# Altium schematic sheet Page-7.schdoc: I/O Addon
size 207 x 119 mm; CompanyName: InSYS; DrawnBy: NaveenKumar; Revision: 2.0; SheetNumber: 7; SheetTotal: 10; Title2: Gateway
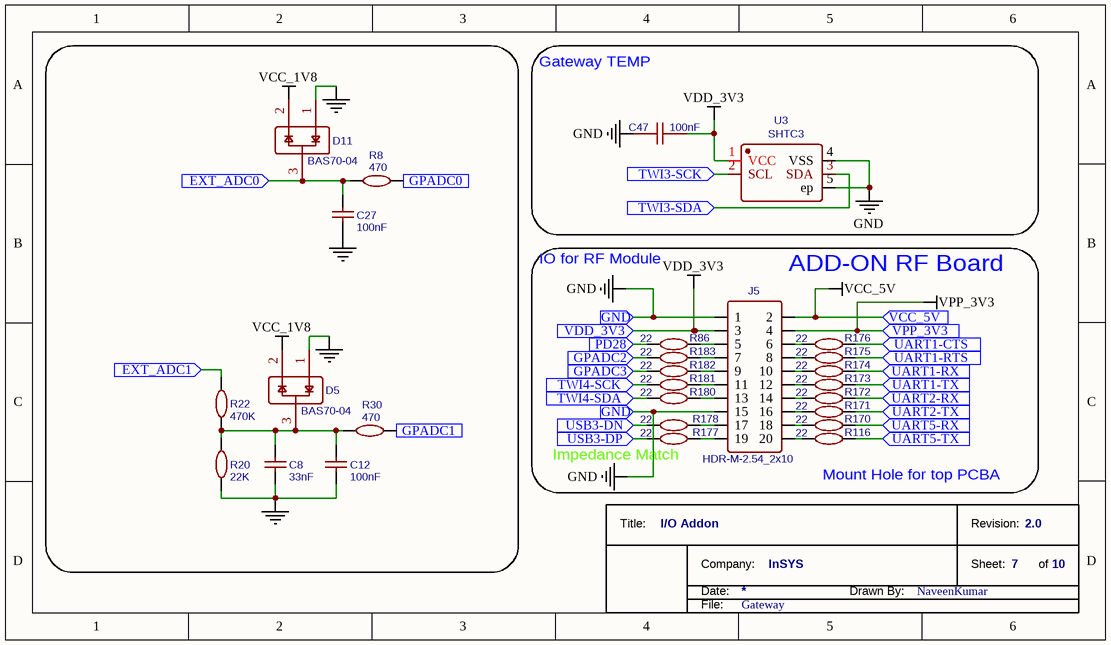
[diagram p0: Page-7.schdoc]

## Parts
*  TitleBlock_1  (value not drawn)  (graphical)
C8  33nF  [GWAY_Capacitor_0603]
C12  100nF  [GWAY_Capacitor_0603]
C27  100nF  [GWAY_Capacitor_0603]
C47  100nF  [GWAY_Capacitor_0603]
D5  BAS70-04  [GWAY_SOT23-3PIN]
D11  BAS70-04  [GWAY_SOT23-3PIN]
J5  HDR-M-2.54_2x10  [GWAY_2x10way_HEADER_CONN]
R8  470  [GWAY_Resistor_0603]
R20  22K  [GWAY_Resistor_0805]
R22  470K  [GWAY_Resistor_0603]
R30  470  [GWAY_Resistor_0603]
R86  22  [GWAY_Resistor_0603]
R116  22  [GWAY_Resistor_0603]
R170  22  [GWAY_Resistor_0603]
R171  22  [GWAY_Resistor_0603]
R172  22  [GWAY_Resistor_0603]
R173  22  [GWAY_Resistor_0603]
R174  22  [GWAY_Resistor_0603]
R175  22  [GWAY_Resistor_0603]
R176  22  [GWAY_Resistor_0603]
R177  22  [GWAY_Resistor_0603]
R178  22  [GWAY_Resistor_0603]
R180  22  [GWAY_Resistor_0603]
R181  22  [GWAY_Resistor_0603]
R182  22  [GWAY_Resistor_0603]
R183  22  [GWAY_Resistor_0603]
U3  SHTC3  [GWAY_DFN4_SHTC3]

## Blocks framed on the sheet
Gateway TEMP: C47 U3
ADD-ON RF Board: J5 R86 R116 R170-R178 R180-R183

## Ports
EXT_ADC0 (in), EXT_ADC1 (in), GND (in), GPADC0 (in), GPADC1 (in), GPADC2 (in), GPADC3 (in), PD28 (in), TWI3-SCK (in), TWI3-SDA (in), TWI4-SCK (in), TWI4-SDA (in), UART1-CTS (in), UART1-RTS (in), UART1-RX (in), UART1-TX (in), UART2-RX (in), UART2-TX (in), UART5-RX (in), UART5-TX (in), USB3-DN (in), USB3-DP (in), VCC_5V (in), VDD_3V3 (in), VPP_3V3 (in)

## Nets
GND: C8.1 C12.1 C27.1 C47.1 D5.1 D11.1 J5.1 J5.15 R20.1 U3.4(VSS) U3.5(ep) ; port GND
VCC_1V8: D5.2 D11.2
VCC_5V: J5.2 ; port VCC_5V
VDD_3V3: C47.2 J5.3 U3.1(VCC) ; port VDD_3V3
VPP_3V3: J5.4 ; port VPP_3V3
EXT_ADC0: C27.2 D11.3 R8.1 ; port EXT_ADC0
EXT_ADC1: R22.2 ; port EXT_ADC1
GPADC0: R8.2 ; port GPADC0
GPADC1: R30.2 ; port GPADC1
GPADC2: R183.1 ; port GPADC2
GPADC3: R182.1 ; port GPADC3
PD28: R86.1 ; port PD28
TWI3-SCK: U3.2(SCL) ; port TWI3-SCK
TWI3-SDA: U3.3(SDA) ; port TWI3-SDA
TWI4-SCK: R181.1 ; port TWI4-SCK
TWI4-SDA: R180.1 ; port TWI4-SDA
UART1-CTS: R176.2 ; port UART1-CTS
UART1-RTS: R175.2 ; port UART1-RTS
UART1-RX: R174.2 ; port UART1-RX
UART1-TX: R173.2 ; port UART1-TX
UART2-RX: R172.2 ; port UART2-RX
UART2-TX: R171.2 ; port UART2-TX
UART5-RX: R170.2 ; port UART5-RX
UART5-TX: R116.2 ; port UART5-TX
USB3-DN: R178.1 ; port USB3-DN
USB3-DP: R177.1 ; port USB3-DP
NetC8_2: C8.2 C12.2 D5.3 R20.2 R22.1 R30.1
NetJ5_5: J5.5 R86.2
NetJ5_6: J5.6 R176.1
NetJ5_7: J5.7 R183.2
NetJ5_8: J5.8 R175.1
NetJ5_9: J5.9 R182.2
NetJ5_10: J5.10 R174.1
NetJ5_11: J5.11 R181.2
NetJ5_12: J5.12 R173.1
NetJ5_13: J5.13 R180.2
NetJ5_14: J5.14 R172.1
NetJ5_16: J5.16 R171.1
NetJ5_17: J5.17 R178.2
NetJ5_18: J5.18 R170.1
NetJ5_19: J5.19 R177.2
NetJ5_20: J5.20 R116.1

## Notes on the sheet
- IO for RF Module
- (near R177) Impedance Match
- Mount Hole for top PCBA
- (in symbol TitleBlock_1) Title:; Revision:; Company:; Sheet:; of; Date:; Drawn By:; File:

## Library data of the parts
* = TitleBlock_1: TitleBlock  No-2; TitleName: *; Company: *; Drawn By: *; File: *
C8 = 33nF: Manufacturer Part: CL10B333KB8NNNC; Manufacturer: SAMSUNG; nameAlias: Capacitance; SMT Type: Basic; Supplier: LCSC; LCSC Assembly: Yes; Supplier Part: C21117; spicePre: C; spiceSymbolName: CL10B333KB8NNNC
C12 C27 = 100nF: Manufacturer Part: CL10F104ZB8NNNC; Manufacturer: SAMSUNG; nameAlias: Capacitance; Supplier: LCSC; Supplier Part: C1688; spicePre: C; spiceSymbolName: CL10F104ZB8NNNC
C47 = 100nF: Manufacturer: SAMSUNG; Manufacturer Part: CL10B104KB8NNNC; nameAlias: Capacitance; Supplier: LCSC; Supplier Part: C1591; spicePre: C; spiceSymbolName: CL10B104KB8NNNC
D5 D11 = BAS70-04: Manufacturer: CJ; Contributor: LCSC; Supplier: LCSC; Manufacturer Part: BAS70-04; Supplier Part: C77298; spicePre: D
J5 = HDR-M-2.54_2x10: Contributor: LCEDA_Lib; Supplier Part: C124359; Supplier: LCSC; spicePre: J; spiceSymbolName: HDR-M-2.54_2x10
R8 R30 = 470: Manufacturer: YAGEO; Manufacturer Part: RC0603FR-07470RL; nameAlias: Resistance (Ohms); Supplier: LCSC; Supplier Part: C114669; spicePre: R; spiceSymbolName: RC0603FR-07470RL
R20 = 22K: Manufacturer: YAGEO; Manufacturer Part: RC0805JR-0722KL; nameAlias: Resistance (Ohms); Supplier: LCSC; Supplier Part: C114231; spicePre: R; spiceSymbolName: RC0805JR-0722KL
R22 = 470K: Manufacturer: YAGEO; Manufacturer Part: RC0603FR-07470KL; nameAlias: Resistance (Ohms); Supplier: LCSC; Supplier Part: C114622; spicePre: R; spiceSymbolName: RC0603FR-07470KL
R86 R116 R170-R178 R180-R183 = 22: Manufacturer: YAGEO; Manufacturer Part: RC0603FR-0722RL; nameAlias: Resistance (Ohms); Supplier: LCSC; Supplier Part: C107701; spicePre: R; spiceSymbolName: RC0603FR-0722RL
U3 = SHTC3: Manufacturer: Sensirion(瑞士盛思锐); Contributor: LCSC; Supplier: LCSC; Supplier Part: C194656; Manufacturer Part: SHTC3; JLCPCB Part Class: Extended Part; spicePre: U; spiceSymbolName: SHTC3